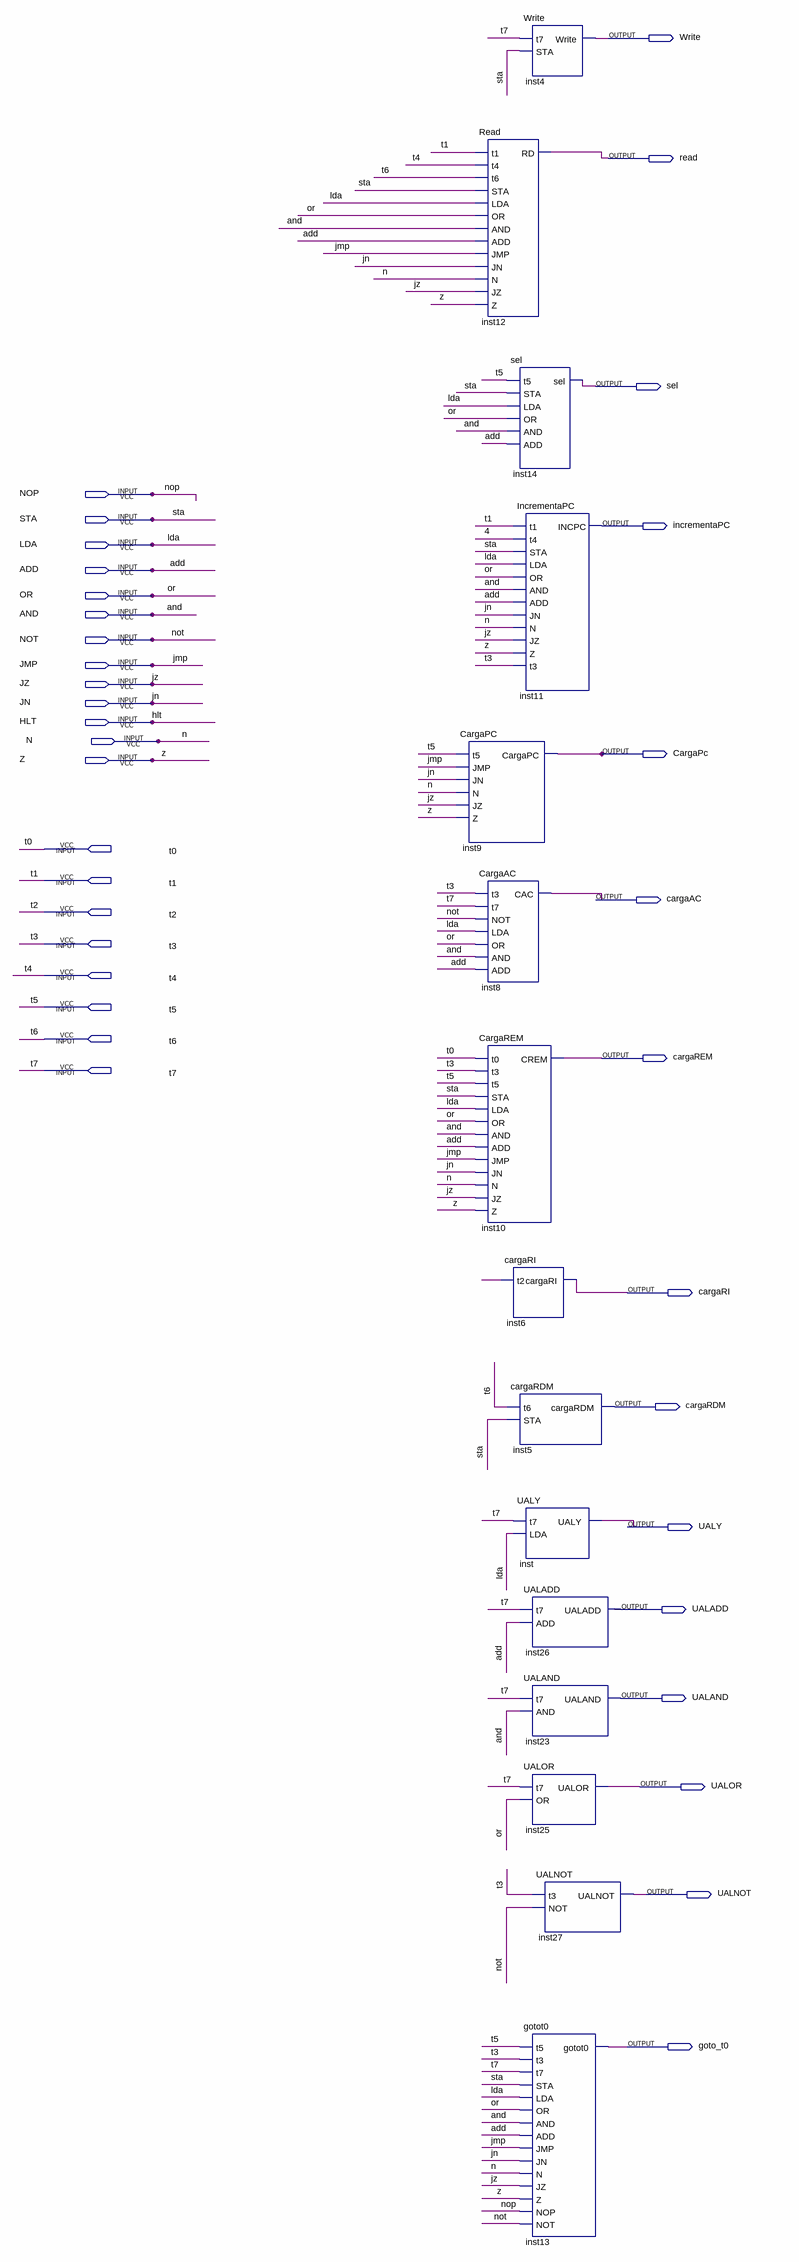
[diagram p0: schematic sheet]
// Quartus schematic Block2.bdf as structural Verilog: 15 symbols, 36 pins
module Block2 (
  input  NOP,
  input  STA,
  input  LDA,
  input  ADD,
  input  OR,
  input  AND,
  input  NOT,
  input  JMP,
  input  JZ,
  input  JN,
  input  HLT,
  input  N,
  input  Z,
  input  t0,
  input  t1,
  input  t2,
  input  t3,
  input  t4,
  input  t5,
  input  t6,
  input  t7,
  output Write,
  output read,
  output sel,
  output incrementaPC,
  output CargaPc,
  output cargaAC,
  output cargaREM,
  output cargaRI,
  output cargaRDM,
  output UALY,
  output UALADD,
  output UALAND,
  output UALOR,
  output UALNOT,
  output goto_t0
);

  wire \4 , undriven;

  CargaPC inst9 (.t5(t5), .JMP(JMP), .JN(JN), .N(N), .JZ(JZ), .Z(Z), .CargaPC(CargaPc));
  Read inst12 (
    .t1(t1), .t4(t4), .t6(t6), .STA(STA), .LDA(LDA), .OR(OR), .AND(AND), .ADD(ADD), .JMP(JMP), .JN(JN),
    .N(N), .JZ(JZ), .Z(Z), .RD(read));
  sel inst14 (.t5(t5), .STA(STA), .LDA(LDA), .OR(OR), .AND(AND), .ADD(ADD), .sel(sel));
  IncrementaPC inst11 (
    .t1(t1), .t4(\4 ), .STA(STA), .LDA(LDA), .OR(OR), .AND(AND), .ADD(ADD), .JN(JN), .N(N), .JZ(JZ), .Z(Z),
    .t3(t3), .INCPC(incrementaPC));
  CargaAC inst8 (.t3(t3), .t7(t7), .NOT(NOT), .LDA(LDA), .OR(OR), .AND(AND), .ADD(ADD), .CAC(cargaAC));
  CargaREM inst10 (
    .t0(t0), .t3(t3), .t5(t5), .STA(STA), .LDA(LDA), .OR(OR), .AND(AND), .ADD(ADD), .JMP(JMP), .JN(JN),
    .N(N), .JZ(JZ), .Z(Z), .CREM(cargaREM));
  cargaRI inst6 (.t2(undriven), .cargaRI(cargaRI));
  cargaRDM inst5 (.t6(t6), .STA(STA), .cargaRDM(cargaRDM));
  UALY inst (.t7(t7), .LDA(LDA), .UALY(UALY));
  Write inst4 (.t7(t7), .STA(STA), .Write(Write));
  UALADD inst26 (.t7(t7), .ADD(ADD), .UALADD(UALADD));
  UALAND inst23 (.t7(t7), .AND(AND), .UALAND(UALAND));
  UALOR inst25 (.t7(t7), .OR(OR), .UALOR(UALOR));
  UALNOT inst27 (.t3(t3), .NOT(NOT), .UALNOT(UALNOT));
  gotot0 inst13 (
    .t5(t5), .t3(t3), .t7(t7), .STA(STA), .LDA(LDA), .OR(OR), .AND(AND), .ADD(ADD), .JMP(JMP), .JN(JN),
    .N(N), .JZ(JZ), .Z(Z), .NOP(NOP), .NOT(NOT), .gotot0(goto_t0));
endmodule
